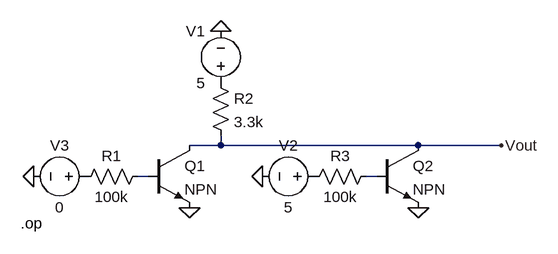
[diagram p0: schematic D4-DÇ3.asc]
D4-DÇ3.asc, the LTspice schematic file:
Version 4
SHEET 1 880 680
WIRE 288 80 288 64
WIRE 288 80 240 80
WIRE 592 80 288 80
WIRE 720 80 592 80
WIRE 176 128 160 128
WIRE 528 128 512 128
FLAG 240 176 0
FLAG 592 176 0
FLAG 288 -96 0
FLAG 720 80 Vout
FLAG 352 128 0
FLAG 0 128 0
SYMBOL res 176 112 R90
WINDOW 0 0 56 VBottom 2
WINDOW 3 32 56 VTop 2
SYMATTR InstName R1
SYMATTR Value 100k
SYMBOL res 272 -32 R0
SYMATTR InstName R2
SYMATTR Value 3.3k
SYMBOL res 528 112 R90
WINDOW 0 0 56 VBottom 2
WINDOW 3 32 56 VTop 2
SYMATTR InstName R3
SYMATTR Value 100k
SYMBOL npn 528 80 R0
SYMATTR InstName Q2
SYMBOL npn 176 80 R0
SYMATTR InstName Q1
SYMBOL voltage 288 0 R180
WINDOW 0 24 96 Left 2
WINDOW 3 24 16 Left 2
WINDOW 123 0 0 Left 0
WINDOW 39 0 0 Left 0
SYMATTR InstName V1
SYMATTR Value 5
SYMBOL voltage 448 128 R90
WINDOW 0 -32 56 VBottom 2
WINDOW 3 32 56 VTop 2
WINDOW 123 0 0 Left 0
WINDOW 39 0 0 Left 0
SYMATTR InstName V2
SYMATTR Value 5
SYMBOL voltage 96 128 R90
WINDOW 0 -32 56 VBottom 2
WINDOW 3 32 56 VTop 2
WINDOW 123 0 0 Left 0
WINDOW 39 0 0 Left 0
SYMATTR InstName V3
SYMATTR Value 0
TEXT -20 200 Left 2 !.op

The netlist it stands for:
* D4-DÇ3.asc
R1 N001 P001 100k
R2 P002 Vout 3.3k
R3 N002 P003 100k
Q2 Vout N002 0 0 NPN
Q1 Vout N001 0 0 NPN
V1 P002 0 5
V2 P003 0 5
V3 P001 0 0
.model NPN NPN
.model PNP PNP
.lib standard.bjt
.op
.backanno
.end